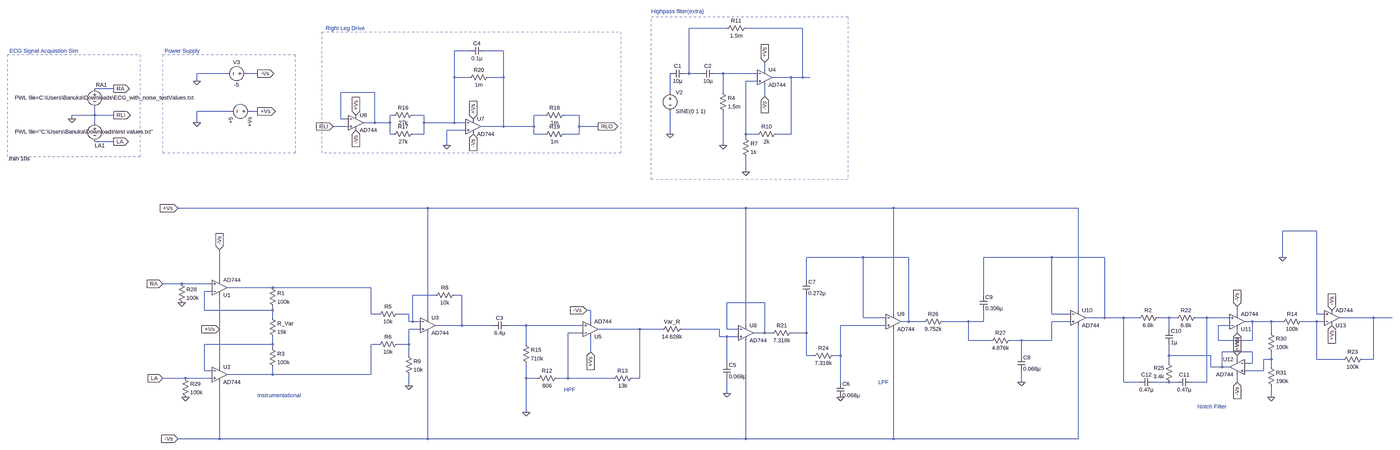
[diagram p0: schematic ECGsimulation[1].asc, whole sheet]
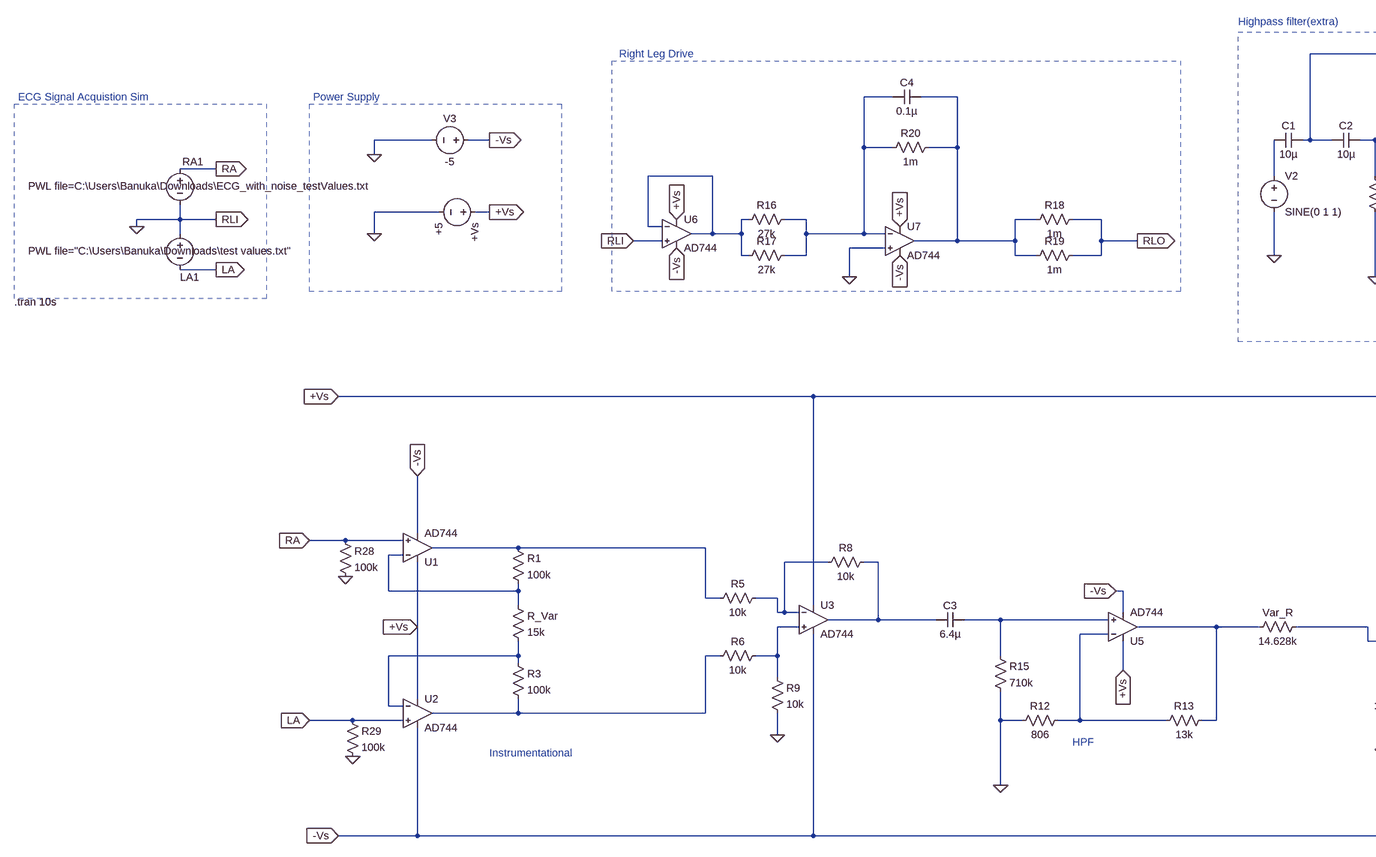
[diagram p1: schematic ECGsimulation[1].asc, part, row 1 of 1, column 1 of 2]
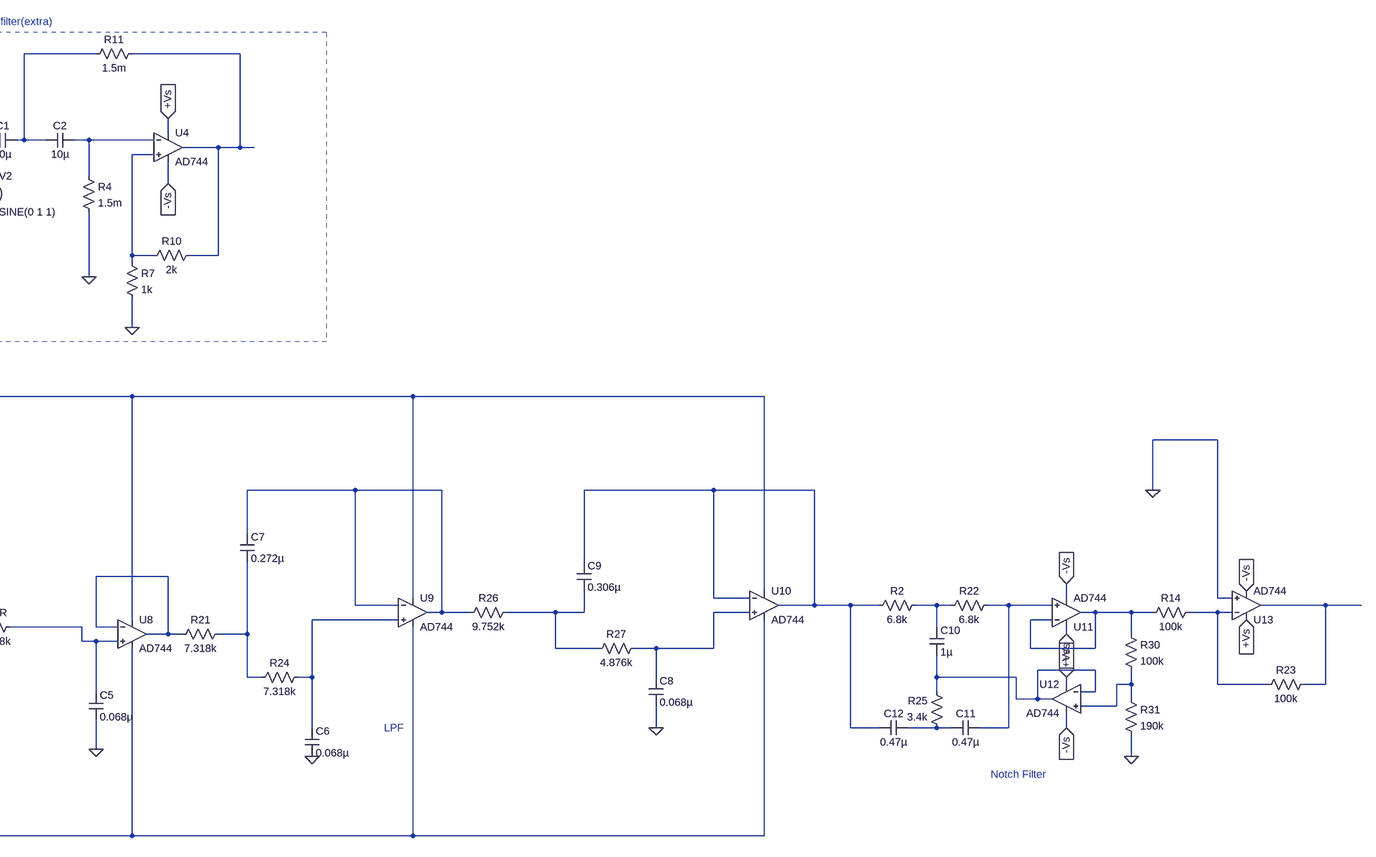
[diagram p2: schematic ECGsimulation[1].asc, part, row 1 of 1, column 2 of 2]
ECGsimulation[1].asc, the LTspice schematic file:
Version 4
SHEET 1 4836 1140
WIRE 2016 -1216 1856 -1216
WIRE 2336 -1216 2096 -1216
WIRE 928 -1120 864 -1120
WIRE 1072 -1120 992 -1120
WIRE 2176 -1040 2176 -1072
WIRE -96 -1024 -224 -1024
WIRE 32 -1024 -16 -1024
WIRE 1856 -1024 1856 -1216
WIRE 1856 -1024 1840 -1024
WIRE 1904 -1024 1856 -1024
WIRE 2000 -1024 1968 -1024
WIRE 2144 -1024 2000 -1024
WIRE 864 -1008 864 -1120
WIRE 928 -1008 864 -1008
WIRE 1072 -1008 1072 -1120
WIRE 1072 -1008 1008 -1008
WIRE 2288 -1008 2208 -1008
WIRE 2336 -1008 2336 -1216
WIRE 2336 -1008 2288 -1008
WIRE 2368 -1008 2336 -1008
WIRE -224 -992 -224 -1024
WIRE 2144 -992 2096 -992
WIRE -576 -960 -656 -960
WIRE 528 -944 384 -944
WIRE 1776 -944 1776 -1024
WIRE 2000 -944 2000 -1024
WIRE 2176 -928 2176 -976
WIRE -80 -864 -224 -864
WIRE 32 -864 0 -864
WIRE -656 -848 -656 -880
WIRE -656 -848 -752 -848
WIRE -576 -848 -656 -848
WIRE 608 -848 592 -848
WIRE 736 -848 688 -848
WIRE 1248 -848 1200 -848
WIRE 1392 -848 1328 -848
WIRE -752 -832 -752 -848
WIRE 384 -832 384 -944
WIRE 416 -832 384 -832
WIRE -656 -816 -656 -848
WIRE -224 -816 -224 -864
WIRE 528 -816 528 -944
WIRE 528 -816 480 -816
WIRE 592 -816 592 -848
WIRE 592 -816 528 -816
WIRE 736 -816 736 -848
WIRE 864 -816 864 -1008
WIRE 864 -816 736 -816
WIRE 912 -816 864 -816
WIRE 416 -800 352 -800
WIRE 1072 -800 1072 -1008
WIRE 1072 -800 976 -800
WIRE 1200 -800 1200 -848
WIRE 1200 -800 1072 -800
WIRE 1392 -800 1392 -848
WIRE 1472 -800 1392 -800
WIRE 912 -784 832 -784
WIRE 592 -768 592 -816
WIRE 608 -768 592 -768
WIRE 736 -768 736 -816
WIRE 736 -768 688 -768
WIRE 1200 -768 1200 -800
WIRE 1248 -768 1200 -768
WIRE 1392 -768 1392 -800
WIRE 1392 -768 1328 -768
WIRE 1776 -768 1776 -864
WIRE 2096 -768 2096 -992
WIRE 2144 -768 2096 -768
WIRE 2288 -768 2288 -1008
WIRE 2288 -768 2224 -768
WIRE 2096 -752 2096 -768
WIRE -576 -736 -656 -736
WIRE 832 -720 832 -784
WIRE 2000 -720 2000 -864
WIRE 2096 -608 2096 -672
WIRE 752 -224 -304 -224
WIRE 2096 -224 752 -224
WIRE 2720 -224 2096 -224
WIRE 3504 -224 2720 -224
WIRE 4512 -128 4368 -128
WIRE 2592 -16 2352 -16
WIRE 2784 -16 2592 -16
WIRE 3392 -16 3104 -16
WIRE 3616 -16 3392 -16
WIRE 4368 -16 4368 -128
WIRE -128 80 -128 -48
WIRE 2352 80 2352 -16
WIRE -288 96 -368 96
WIRE -160 96 -288 96
WIRE 96 112 -96 112
WIRE 512 112 96 112
WIRE -160 128 -192 128
WIRE 784 144 688 144
WIRE 896 144 864 144
WIRE 3104 144 3104 -16
WIRE 2176 176 2016 176
WIRE -192 208 -192 128
WIRE 96 208 96 192
WIRE 96 208 -192 208
WIRE 1440 208 1424 208
WIRE 3504 208 3504 -224
WIRE 512 224 512 112
WIRE 544 224 512 224
WIRE 672 224 624 224
WIRE 2720 224 2720 -224
WIRE 3392 224 3392 -16
WIRE 3472 224 3392 224
WIRE 4176 224 4176 192
WIRE 4512 224 4512 -128
WIRE 4544 224 4512 224
WIRE 96 240 96 208
WIRE 752 240 752 -224
WIRE 2592 240 2592 -16
WIRE 2688 240 2592 240
WIRE 3616 240 3616 -16
WIRE 3616 240 3536 240
WIRE 3696 240 3616 240
WIRE 3760 240 3696 240
WIRE 3888 240 3840 240
WIRE 3920 240 3888 240
WIRE 4048 240 4000 240
WIRE 4144 240 4048 240
WIRE 4752 240 4608 240
WIRE 4832 240 4752 240
WIRE 672 256 672 224
WIRE 688 256 688 144
WIRE 688 256 672 256
WIRE 720 256 688 256
WIRE 1440 256 1440 208
WIRE 2784 256 2784 -16
WIRE 2784 256 2752 256
WIRE 2848 256 2784 256
WIRE 3040 256 2928 256
WIRE 3104 256 3104 208
WIRE 3104 256 3040 256
WIRE 3472 256 3392 256
WIRE 4240 256 4208 256
WIRE 4320 256 4240 256
WIRE 4368 256 4320 256
WIRE 4512 256 4448 256
WIRE 4544 256 4512 256
WIRE 896 272 896 144
WIRE 896 272 784 272
WIRE 1024 272 896 272
WIRE 1168 272 1088 272
WIRE 1408 272 1168 272
WIRE 2096 272 2096 -224
WIRE 2688 272 2496 272
WIRE 4144 272 4096 272
WIRE -128 288 -128 144
WIRE 720 288 672 288
WIRE 1648 288 1472 288
WIRE 1744 288 1648 288
WIRE 1984 288 1824 288
WIRE 2016 288 2016 176
WIRE 2064 288 2016 288
WIRE 3888 288 3888 240
WIRE 1408 304 1344 304
WIRE 2176 304 2176 176
WIRE 2176 304 2128 304
WIRE 2208 304 2176 304
WIRE 2352 304 2352 144
WIRE 2352 304 2288 304
WIRE 4176 304 4176 288
WIRE 4320 304 4320 256
WIRE 1984 320 1984 288
WIRE 2016 320 1984 320
WIRE 2064 320 2016 320
WIRE 3040 336 3040 256
WIRE 3136 336 3040 336
WIRE 3264 336 3216 336
WIRE 3392 336 3392 256
WIRE 3392 336 3264 336
WIRE 4096 336 4096 272
WIRE 4240 336 4240 256
WIRE 4240 336 4096 336
WIRE 96 352 96 320
WIRE 96 352 -192 352
WIRE 544 352 512 352
WIRE 672 352 672 288
WIRE 672 352 624 352
WIRE 1168 352 1168 272
WIRE 96 368 96 352
WIRE 1440 384 1440 320
WIRE 4240 384 4112 384
WIRE 672 400 672 352
WIRE 2352 400 2352 304
WIRE 2384 400 2352 400
WIRE 2496 400 2496 272
WIRE 2496 400 2464 400
WIRE 3264 400 3264 336
WIRE 3888 400 3888 352
WIRE 4064 400 3888 400
WIRE 4176 416 4176 400
WIRE 4320 416 4320 384
WIRE 4320 416 4288 416
WIRE 4512 416 4512 256
WIRE 4624 416 4512 416
WIRE 4752 416 4752 240
WIRE 4752 416 4704 416
WIRE 2016 432 2016 320
WIRE 3888 432 3888 400
WIRE 4240 432 4240 384
WIRE 4240 432 4208 432
WIRE -128 448 -128 288
WIRE 4064 448 4064 400
WIRE 4112 448 4112 384
WIRE 4112 448 4064 448
WIRE 4144 448 4112 448
WIRE 4320 448 4320 416
WIRE -192 464 -192 352
WIRE -160 464 -192 464
WIRE 4288 464 4288 416
WIRE 4288 464 4208 464
WIRE 96 480 96 448
WIRE 96 480 -96 480
WIRE 512 480 512 352
WIRE 512 480 96 480
WIRE -272 496 -368 496
WIRE -160 496 -272 496
WIRE 1168 496 1168 432
WIRE 1216 496 1168 496
WIRE 1344 496 1344 304
WIRE 1344 496 1296 496
WIRE 1536 496 1344 496
WIRE 1648 496 1648 288
WIRE 1648 496 1616 496
WIRE 2496 512 2496 400
WIRE 3264 512 3264 464
WIRE 3696 512 3696 240
WIRE 3760 512 3696 512
WIRE 3888 512 3824 512
WIRE 3920 512 3888 512
WIRE 4048 512 4048 240
WIRE 4048 512 3984 512
WIRE 4176 512 4176 480
WIRE 672 528 672 480
WIRE 2016 560 2016 496
WIRE 4320 576 4320 528
WIRE 1168 640 1168 496
WIRE -128 752 -128 512
WIRE -128 752 -304 752
WIRE 752 752 752 304
WIRE 752 752 -128 752
WIRE 2096 752 2096 336
WIRE 2096 752 752 752
WIRE 2720 752 2720 288
WIRE 2720 752 2096 752
WIRE 3504 752 3504 272
WIRE 3504 752 2720 752
FLAG 672 528 0
FLAG -128 288 +Vs
IOPIN -128 288 In
FLAG 32 -864 +Vs
IOPIN 32 -864 Out
FLAG -224 -992 0
FLAG 32 -1024 -Vs
IOPIN 32 -1024 Out
FLAG 2000 -720 0
FLAG 2096 -608 0
FLAG 2176 -1072 +Vs
IOPIN 2176 -1072 In
FLAG 2176 -928 -Vs
IOPIN 2176 -928 In
FLAG 1776 -768 0
FLAG 1168 640 0
FLAG 944 -832 +Vs
IOPIN 944 -832 In
FLAG 448 -784 -Vs
IOPIN 448 -784 In
FLAG 944 -768 -Vs
IOPIN 944 -768 In
FLAG 832 -720 0
FLAG 2016 560 0
FLAG 2496 576 0
FLAG 3264 512 0
FLAG -304 -224 +Vs
IOPIN -304 -224 In
FLAG -304 752 -Vs
IOPIN -304 752 In
FLAG -128 -48 -Vs
IOPIN -128 -48 In
FLAG -368 96 RA
IOPIN -368 96 In
FLAG -368 496 LA
IOPIN -368 496 In
FLAG 1424 208 -Vs
IOPIN 1424 208 In
FLAG 1440 384 +Vs
IOPIN 1440 384 In
FLAG -752 -832 0
FLAG -576 -736 LA
IOPIN -576 -736 Out
FLAG -576 -960 RA
IOPIN -576 -960 Out
FLAG -576 -848 RLI
IOPIN -576 -848 Out
FLAG -224 -816 0
FLAG 4176 192 -Vs
IOPIN 4176 192 In
FLAG 4176 304 +Vs
IOPIN 4176 304 In
FLAG 4176 512 -Vs
IOPIN 4176 512 In
FLAG 4176 400 +Vs
IOPIN 4176 400 In
FLAG 4320 576 0
FLAG 448 -848 +Vs
IOPIN 448 -848 In
FLAG 352 -800 RLI
IOPIN 352 -800 In
FLAG 1472 -800 RLO
IOPIN 1472 -800 Out
FLAG 4576 208 -Vs
IOPIN 4576 208 In
FLAG 4576 272 +Vs
IOPIN 4576 272 In
FLAG 4368 -16 0
FLAG -288 176 0
FLAG -272 576 0
SYMBOL OpAmps\\AD744 -128 176 M180
SYMATTR InstName U1
SYMBOL OpAmps\\AD744 -128 416 R0
SYMATTR InstName U2
SYMBOL OpAmps\\AD744 752 208 R0
SYMATTR InstName U3
SYMBOL res 80 96 R0
SYMATTR InstName R1
SYMATTR Value 100k
SYMATTR SpiceLine tol=1
SYMBOL res 80 224 R0
SYMATTR InstName R_Var
SYMATTR Value 15k
SYMBOL res 80 352 R0
SYMATTR InstName R3
SYMATTR Value 100k
SYMATTR SpiceLine tol=1
SYMBOL res 640 208 R90
WINDOW 0 0 56 VBottom 2
WINDOW 3 32 56 VTop 2
SYMATTR InstName R5
SYMATTR Value 10k
SYMBOL res 640 336 R90
WINDOW 0 0 56 VBottom 2
WINDOW 3 32 56 VTop 2
SYMATTR InstName R6
SYMATTR Value 10k
SYMATTR SpiceLine tol=1
SYMBOL res 880 128 R90
WINDOW 0 0 56 VBottom 2
WINDOW 3 32 56 VTop 2
SYMATTR InstName R8
SYMATTR Value 10k
SYMBOL res 656 384 R0
SYMATTR InstName R9
SYMATTR Value 10k
SYMBOL voltage 16 -864 R90
WINDOW 123 0 0 Left 0
WINDOW 39 0 0 Left 0
SYMATTR InstName +Vs
SYMATTR Value +5
SYMBOL voltage 0 -1024 R90
WINDOW 0 -32 56 VBottom 2
WINDOW 3 32 56 VTop 2
WINDOW 123 0 0 Left 0
WINDOW 39 0 0 Left 0
SYMATTR InstName V3
SYMATTR Value -5
SYMBOL OpAmps\\AD744 2176 -1072 R0
SYMATTR InstName U4
SYMBOL cap 1840 -1040 R90
WINDOW 0 0 32 VBottom 2
WINDOW 3 32 32 VTop 2
SYMATTR InstName C1
SYMATTR Value 10µ
SYMBOL cap 1968 -1040 R90
WINDOW 0 0 32 VBottom 2
WINDOW 3 32 32 VTop 2
SYMATTR InstName C2
SYMATTR Value 10µ
SYMBOL res 1984 -960 R0
SYMATTR InstName R4
SYMATTR Value 1.5m
SYMBOL res 2080 -768 R0
SYMATTR InstName R7
SYMATTR Value 1k
SYMBOL res 2240 -784 R90
WINDOW 0 0 56 VBottom 2
WINDOW 3 32 56 VTop 2
SYMATTR InstName R10
SYMATTR Value 2k
SYMBOL res 2112 -1232 R90
WINDOW 0 0 56 VBottom 2
WINDOW 3 32 56 VTop 2
SYMATTR InstName R11
SYMATTR Value 1.5m
SYMBOL voltage 1776 -960 R0
WINDOW 123 0 0 Left 0
WINDOW 39 0 0 Left 0
SYMATTR InstName V2
SYMATTR Value SINE(0 1 1)
SYMBOL OpAmps\\AD744 1440 352 M180
SYMATTR InstName U5
SYMBOL cap 1088 256 R90
WINDOW 0 0 32 VBottom 2
WINDOW 3 32 32 VTop 2
SYMATTR InstName C3
SYMATTR Value 6.4µ
SYMBOL res 1152 336 R0
SYMATTR InstName R15
SYMATTR Value 710k
SYMATTR SpiceLine tol=1
SYMBOL OpAmps\\AD744 448 -880 R0
SYMATTR InstName U6
SYMBOL OpAmps\\AD744 944 -864 R0
SYMATTR InstName U7
SYMBOL res 704 -864 R90
WINDOW 0 0 56 VBottom 2
WINDOW 3 32 56 VTop 2
SYMATTR InstName R16
SYMATTR Value 27k
SYMBOL res 704 -784 R90
WINDOW 0 0 56 VBottom 2
WINDOW 3 32 56 VTop 2
SYMATTR InstName R17
SYMATTR Value 27k
SYMBOL res 1344 -864 R90
WINDOW 0 0 56 VBottom 2
WINDOW 3 32 56 VTop 2
SYMATTR InstName R18
SYMATTR Value 1m
SYMBOL res 1344 -784 R90
WINDOW 0 0 56 VBottom 2
WINDOW 3 32 56 VTop 2
SYMATTR InstName R19
SYMATTR Value 1m
SYMBOL res 1024 -1024 R90
WINDOW 0 0 56 VBottom 2
WINDOW 3 32 56 VTop 2
SYMATTR InstName R20
SYMATTR Value 1m
SYMBOL cap 992 -1136 R90
WINDOW 0 0 32 VBottom 2
WINDOW 3 32 32 VTop 2
SYMATTR InstName C4
SYMATTR Value 0.1µ
SYMBOL OpAmps\\AD744 2096 240 R0
SYMATTR InstName U8
SYMBOL OpAmps\\AD744 2720 192 R0
SYMATTR InstName U9
SYMBOL OpAmps\\AD744 3504 176 R0
SYMATTR InstName U10
SYMBOL res 1840 272 R90
WINDOW 0 0 56 VBottom 2
WINDOW 3 32 56 VTop 2
SYMATTR InstName Var_R
SYMATTR Value 14.628k
SYMBOL res 2480 384 R90
WINDOW 0 0 56 VBottom 2
WINDOW 3 32 56 VTop 2
SYMATTR InstName R24
SYMATTR Value 7.318k
SYMBOL res 2944 240 R90
WINDOW 0 0 56 VBottom 2
WINDOW 3 32 56 VTop 2
SYMATTR InstName R26
SYMATTR Value 9.752k
SYMBOL res 3232 320 R90
WINDOW 0 0 56 VBottom 2
WINDOW 3 32 56 VTop 2
SYMATTR InstName R27
SYMATTR Value 4.876k
SYMBOL cap 2000 432 R0
SYMATTR InstName C5
SYMATTR Value 0.068µ
SYMBOL cap 2480 512 R0
SYMATTR InstName C6
SYMATTR Value 0.068µ
SYMBOL cap 2336 80 R0
SYMATTR InstName C7
SYMATTR Value 0.272µ
SYMBOL cap 3248 400 R0
SYMATTR InstName C8
SYMATTR Value 0.068µ
SYMBOL cap 3088 144 R0
SYMATTR InstName C9
SYMATTR Value 0.306µ
SYMBOL res 2304 288 R90
WINDOW 0 0 56 VBottom 2
WINDOW 3 32 56 VTop 2
SYMATTR InstName R21
SYMATTR Value 7.318k
SYMBOL voltage -656 -976 R0
WINDOW 0 5 0 Left 2
WINDOW 3 -337 54 Left 2
WINDOW 123 0 0 Left 0
WINDOW 39 0 0 Left 0
SYMATTR InstName RA1
SYMATTR Value PWL file=C:\Users\Banuka\Downloads\ECG_with_noise_testValues.txt
SYMBOL voltage -656 -832 R0
WINDOW 0 0 113 Left 2
WINDOW 3 -337 54 Left 2
WINDOW 123 0 0 Left 0
WINDOW 39 0 0 Left 0
SYMATTR InstName LA1
SYMATTR Value PWL file="C:\Users\Banuka\Downloads\test values.txt"
SYMBOL OpAmps\\AD744 4176 320 M180
SYMATTR InstName U11
SYMBOL res 3856 224 R90
WINDOW 0 0 56 VBottom 2
WINDOW 3 32 56 VTop 2
SYMATTR InstName R2
SYMATTR Value 6.8k
SYMBOL res 4016 224 R90
WINDOW 0 0 56 VBottom 2
WINDOW 3 32 56 VTop 2
SYMATTR InstName R22
SYMATTR Value 6.8k
SYMBOL res 3904 528 R180
WINDOW 0 36 76 Left 2
WINDOW 3 36 40 Left 2
SYMATTR InstName R25
SYMATTR Value 3.4k
SYMBOL cap 3872 288 R0
SYMATTR InstName C10
SYMATTR Value 1µ
SYMBOL cap 3984 496 R90
WINDOW 0 0 32 VBottom 2
WINDOW 3 32 32 VTop 2
SYMATTR InstName C11
SYMATTR Value 0.47µ
SYMBOL cap 3824 496 R90
WINDOW 0 0 32 VBottom 2
WINDOW 3 32 32 VTop 2
SYMATTR InstName C12
SYMATTR Value 0.47µ
SYMBOL OpAmps\\AD744 4176 384 M0
SYMATTR InstName U12
SYMBOL res 4304 288 R0
SYMATTR InstName R30
SYMATTR Value 100k
SYMBOL res 4304 432 R0
SYMATTR InstName R31
SYMATTR Value 190k
SYMBOL res 1312 480 R90
WINDOW 0 0 56 VBottom 2
WINDOW 3 32 56 VTop 2
SYMATTR InstName R12
SYMATTR Value 806
SYMBOL res 1632 480 R90
WINDOW 0 0 56 VBottom 2
WINDOW 3 32 56 VTop 2
SYMATTR InstName R13
SYMATTR Value 13k
SYMBOL OpAmps\\AD744 4576 304 M180
SYMATTR InstName U13
SYMBOL res 4464 240 R90
WINDOW 0 0 56 VBottom 2
WINDOW 3 32 56 VTop 2
SYMATTR InstName R14
SYMATTR Value 100k
SYMBOL res 4608 432 R270
WINDOW 0 32 56 VTop 2
WINDOW 3 0 56 VBottom 2
SYMATTR InstName R23
SYMATTR Value 100k
SYMBOL res -304 80 R0
SYMATTR InstName R28
SYMATTR Value 100k
SYMATTR SpiceLine tol=1
SYMBOL res -288 480 R0
SYMATTR InstName R29
SYMATTR Value 100k
SYMATTR SpiceLine tol=1
TEXT 320 -1216 Left 2 ;Right Leg Drive
TEXT 1696 -1288 Left 2 ;Highpass filter(extra)
TEXT 32 568 Left 2 ;Instrumentational
TEXT 1328 544 Left 2 ;HPF
TEXT 2656 512 Left 2 ;LPF
TEXT -1024 -664 Left 2 !.tran 10s
TEXT -360 -1120 Left 2 ;Power Supply
TEXT -1016 -1120 Left 2 ;ECG Signal Acquistion Sim
TEXT 4008 616 Left 2 ;Notch Filter
RECTANGLE Normal -464 -672 -1024 -1104 2
RECTANGLE Normal 192 -688 -368 -1104 2
RECTANGLE Normal 1568 -688 304 -1200 2
RECTANGLE Normal 2528 -576 1696 -1264 2

The netlist it stands for:
* ECGsimulation[1].asc
XU1 RA N012 +Vs -Vs N011 AD744  ; pins In+ In- V+ V- OUT
XU2 LA N030 +Vs -Vs N031 AD744  ; pins In+ In- V+ V- OUT
XU3 N025 N013 +Vs -Vs N014 AD744  ; pins In+ In- V+ V- OUT
R1 N011 N012 100k tol=1
R_Var N012 N030 15k
R3 N030 N031 100k tol=1
R5 N013 N011 10k
R6 N025 N031 10k tol=1
R8 N014 N013 10k
R9 N025 0 10k
V§+Vs +Vs 0 +5
V3 -Vs 0 -5
XU4 N006 N005 +Vs -Vs N002 AD744  ; pins In+ In- V+ V- OUT
C1 N001 N008 10µ
C2 N005 N001 10µ
R4 N005 0 1.5m
R7 N006 0 1k
R10 N002 N006 2k
R11 N002 N001 1.5m
V2 N008 0 SINE(0 1 1)
XU5 N023 N028 +Vs -Vs N026 AD744  ; pins In+ In- V+ V- OUT
C3 N023 N014 6.4µ
R15 N023 0 710k tol=1
XU6 0 N007 +Vs -Vs N007 AD744  ; pins In+ In- V+ V- OUT
XU7 0 N003 +Vs -Vs N004 AD744  ; pins In+ In- V+ V- OUT
R16 N003 N007 27k
R17 N003 N007 27k
R18 RLO N004 1m
R19 RLO N004 1m
R20 N004 N003 1m
C4 N004 N003 0.1µ
XU8 N027 N015 +Vs -Vs N015 AD744  ; pins In+ In- V+ V- OUT
XU9 N024 N009 +Vs -Vs N009 AD744  ; pins In+ In- V+ V- OUT
XU10 N020 N010 +Vs -Vs N010 AD744  ; pins In+ In- V+ V- OUT
R§Var_R N027 N026 14.628k
R24 N024 N029 7.318k
R26 N019 N009 9.752k
R27 N020 N019 4.876k
C5 N027 0 0.068µ
C6 N024 0 0.068µ
C7 N009 N029 0.272µ
C8 N020 0 0.068µ
C9 N010 N019 0.306µ
R21 N029 N015 7.318k
V§RA1 RA 0 PWL file=C:\Users\Banuka\Downloads\ECG_with_noise_testValues.txt
V§LA1 0 LA PWL file="C:\Users\Banuka\Downloads\test values.txt"
XU11 N017 N021 +Vs -Vs N021 AD744  ; pins In+ In- V+ V- OUT
R2 N016 N010 6.8k
R22 N017 N016 6.8k
R25 N034 N032 3.4k
C10 N016 N032 1µ
C11 N017 N034 0.47µ
C12 N034 N010 0.47µ
XU12 N033 N032 +Vs -Vs N032 AD744  ; pins In+ In- V+ V- OUT
R30 N021 N033 100k
R31 N033 0 190k
R12 N028 0 806
R13 N026 N028 13k
XU13 0 N022 +Vs -Vs N018 AD744  ; pins In+ In- V+ V- OUT
R14 N022 N021 100k
R23 N022 N018 100k
R28 RA 0 100k tol=1
R29 LA 0 100k tol=1
* Right Leg Drive
* Highpass filter(extra)
* Instrumentational
* HPF
* LPF
.tran 10s
* Power Supply
* ECG Signal Acquistion Sim
* Notch Filter
.backanno
.end